# EasyEDA Pro project LOONGSON_DOCKER.epro, schematic Schematic1

## Sheets
1 interfaces: Create Date: 2025-02-27; Page Name: interfaces; Project Name: LOONGSON_99PI_DOCKER; Schematic Name: Schematic1; Update Date: 2025-03-01; Company: 嘉立创EDA; Page Size: A4; Version: V1.0
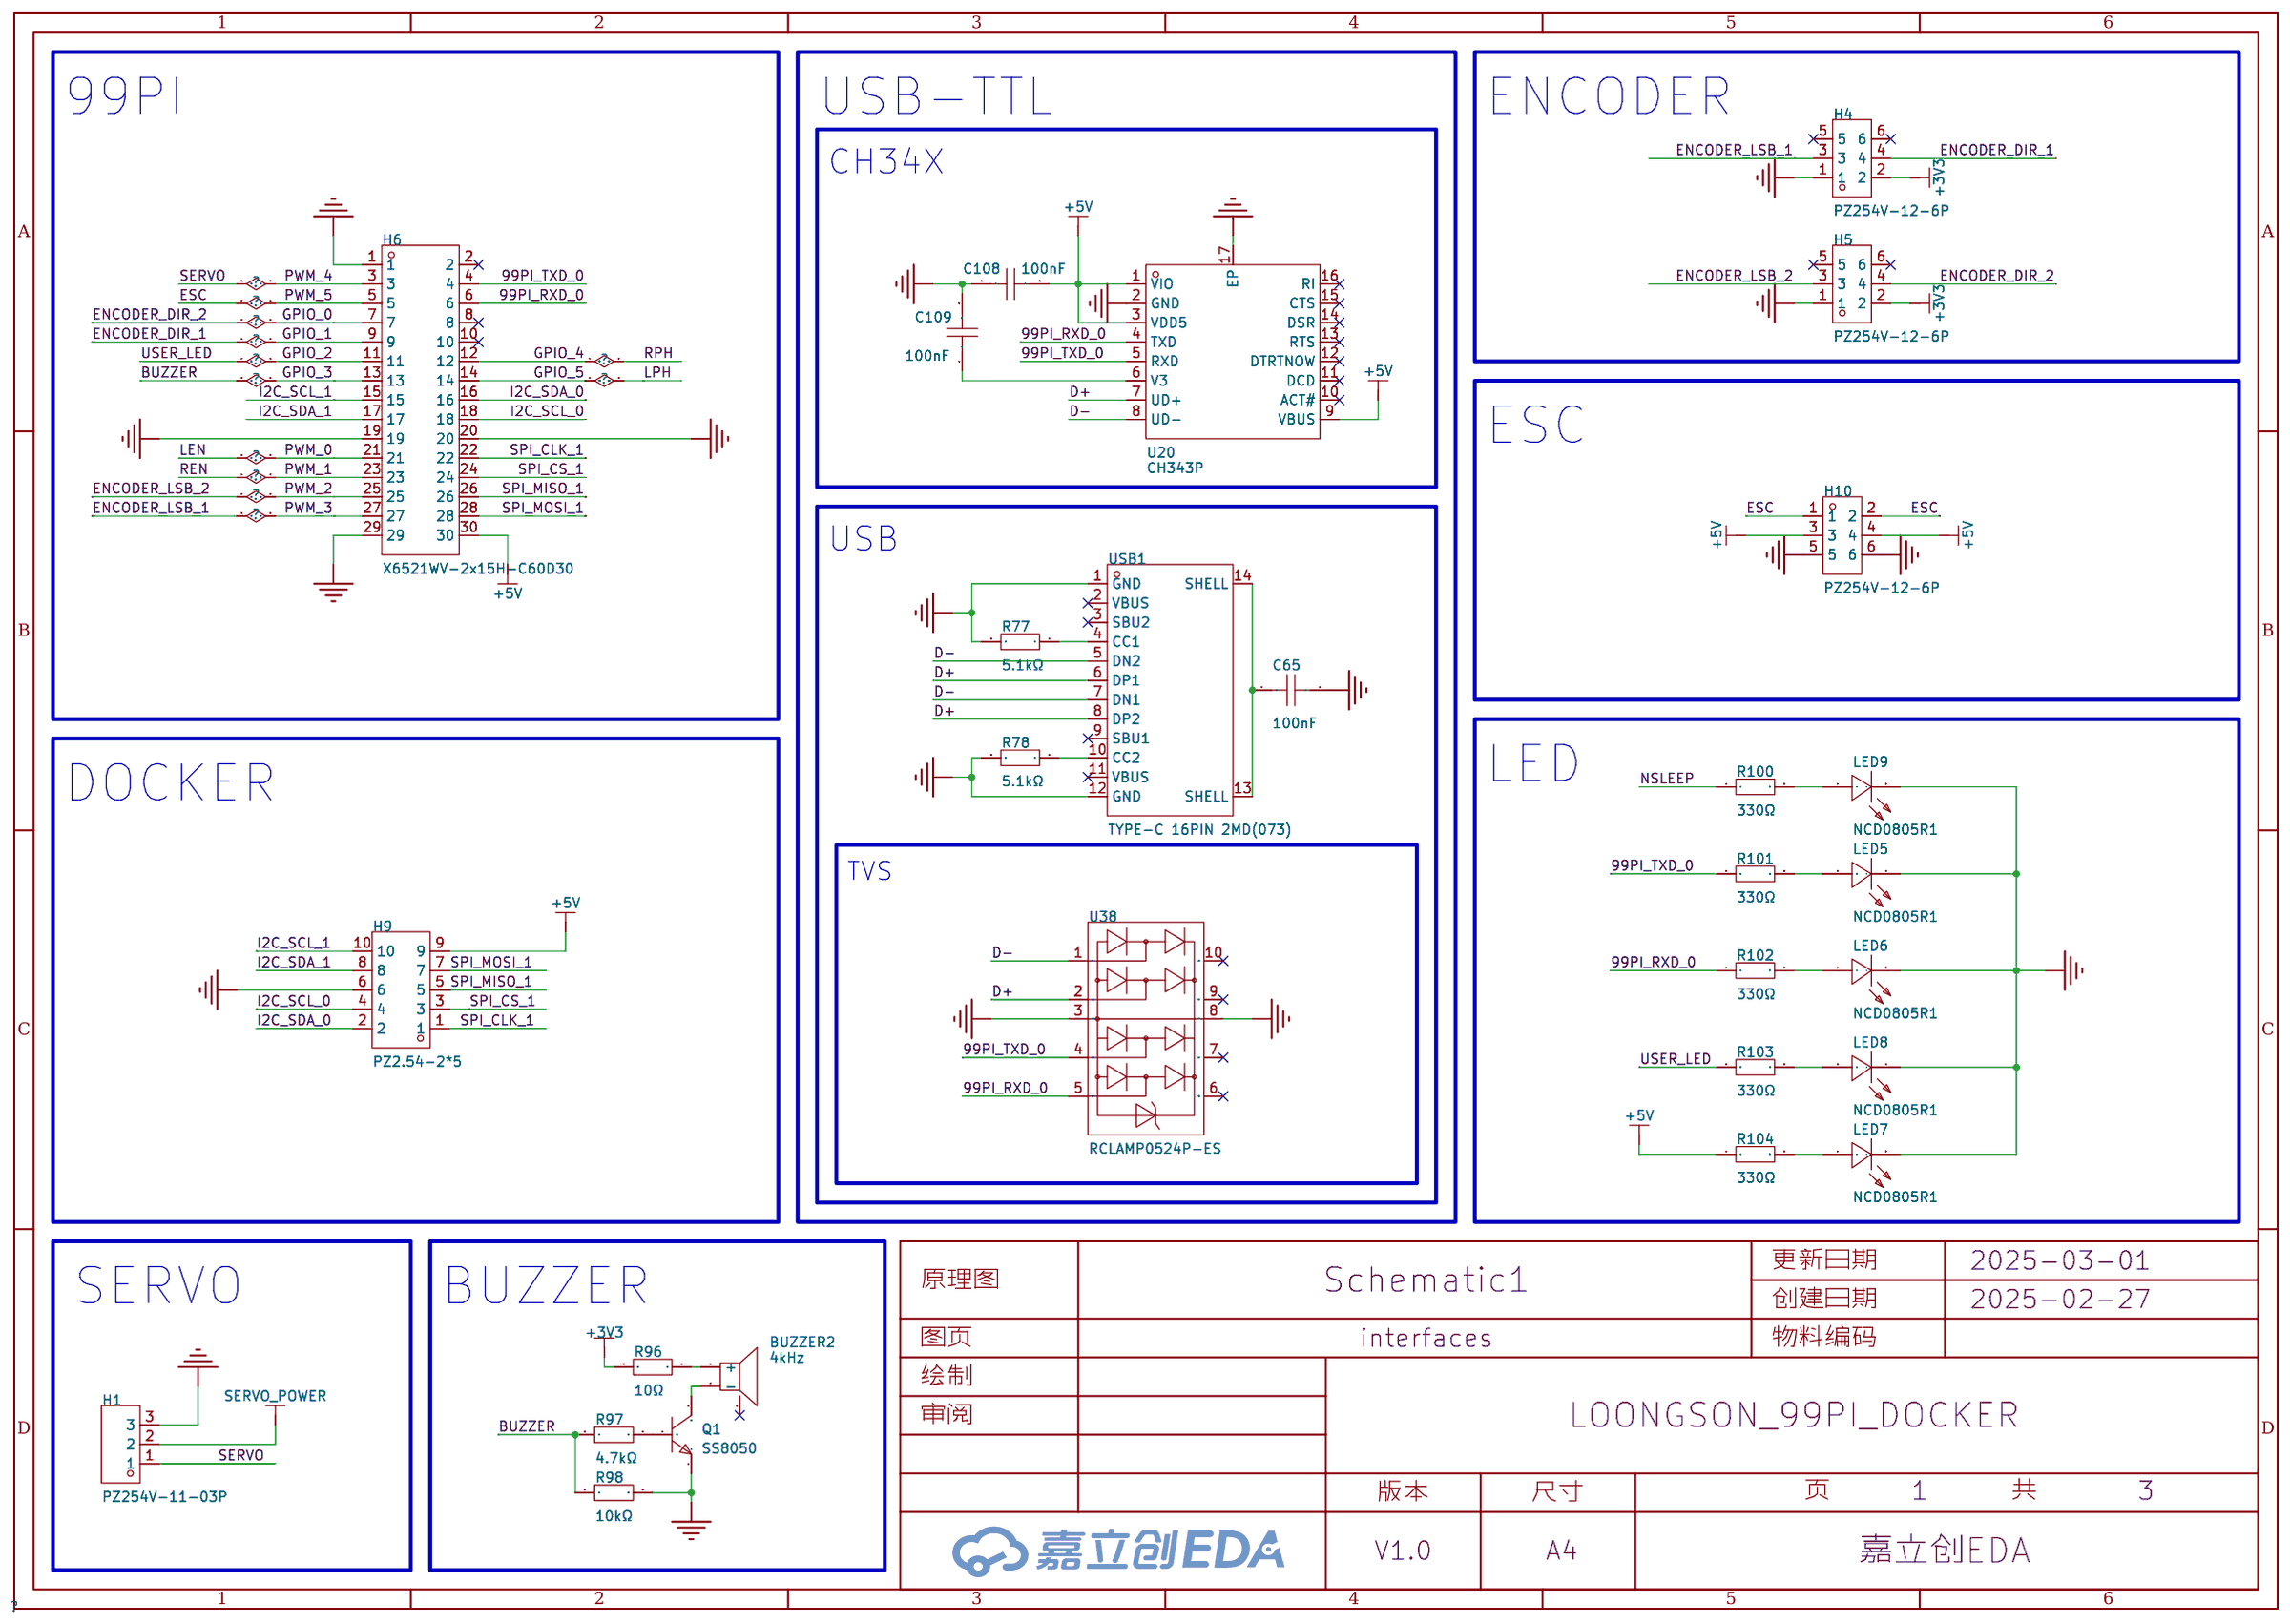
[diagram p0: interfaces]
2 power: Page Name: power; Update Date: 2025-03-06
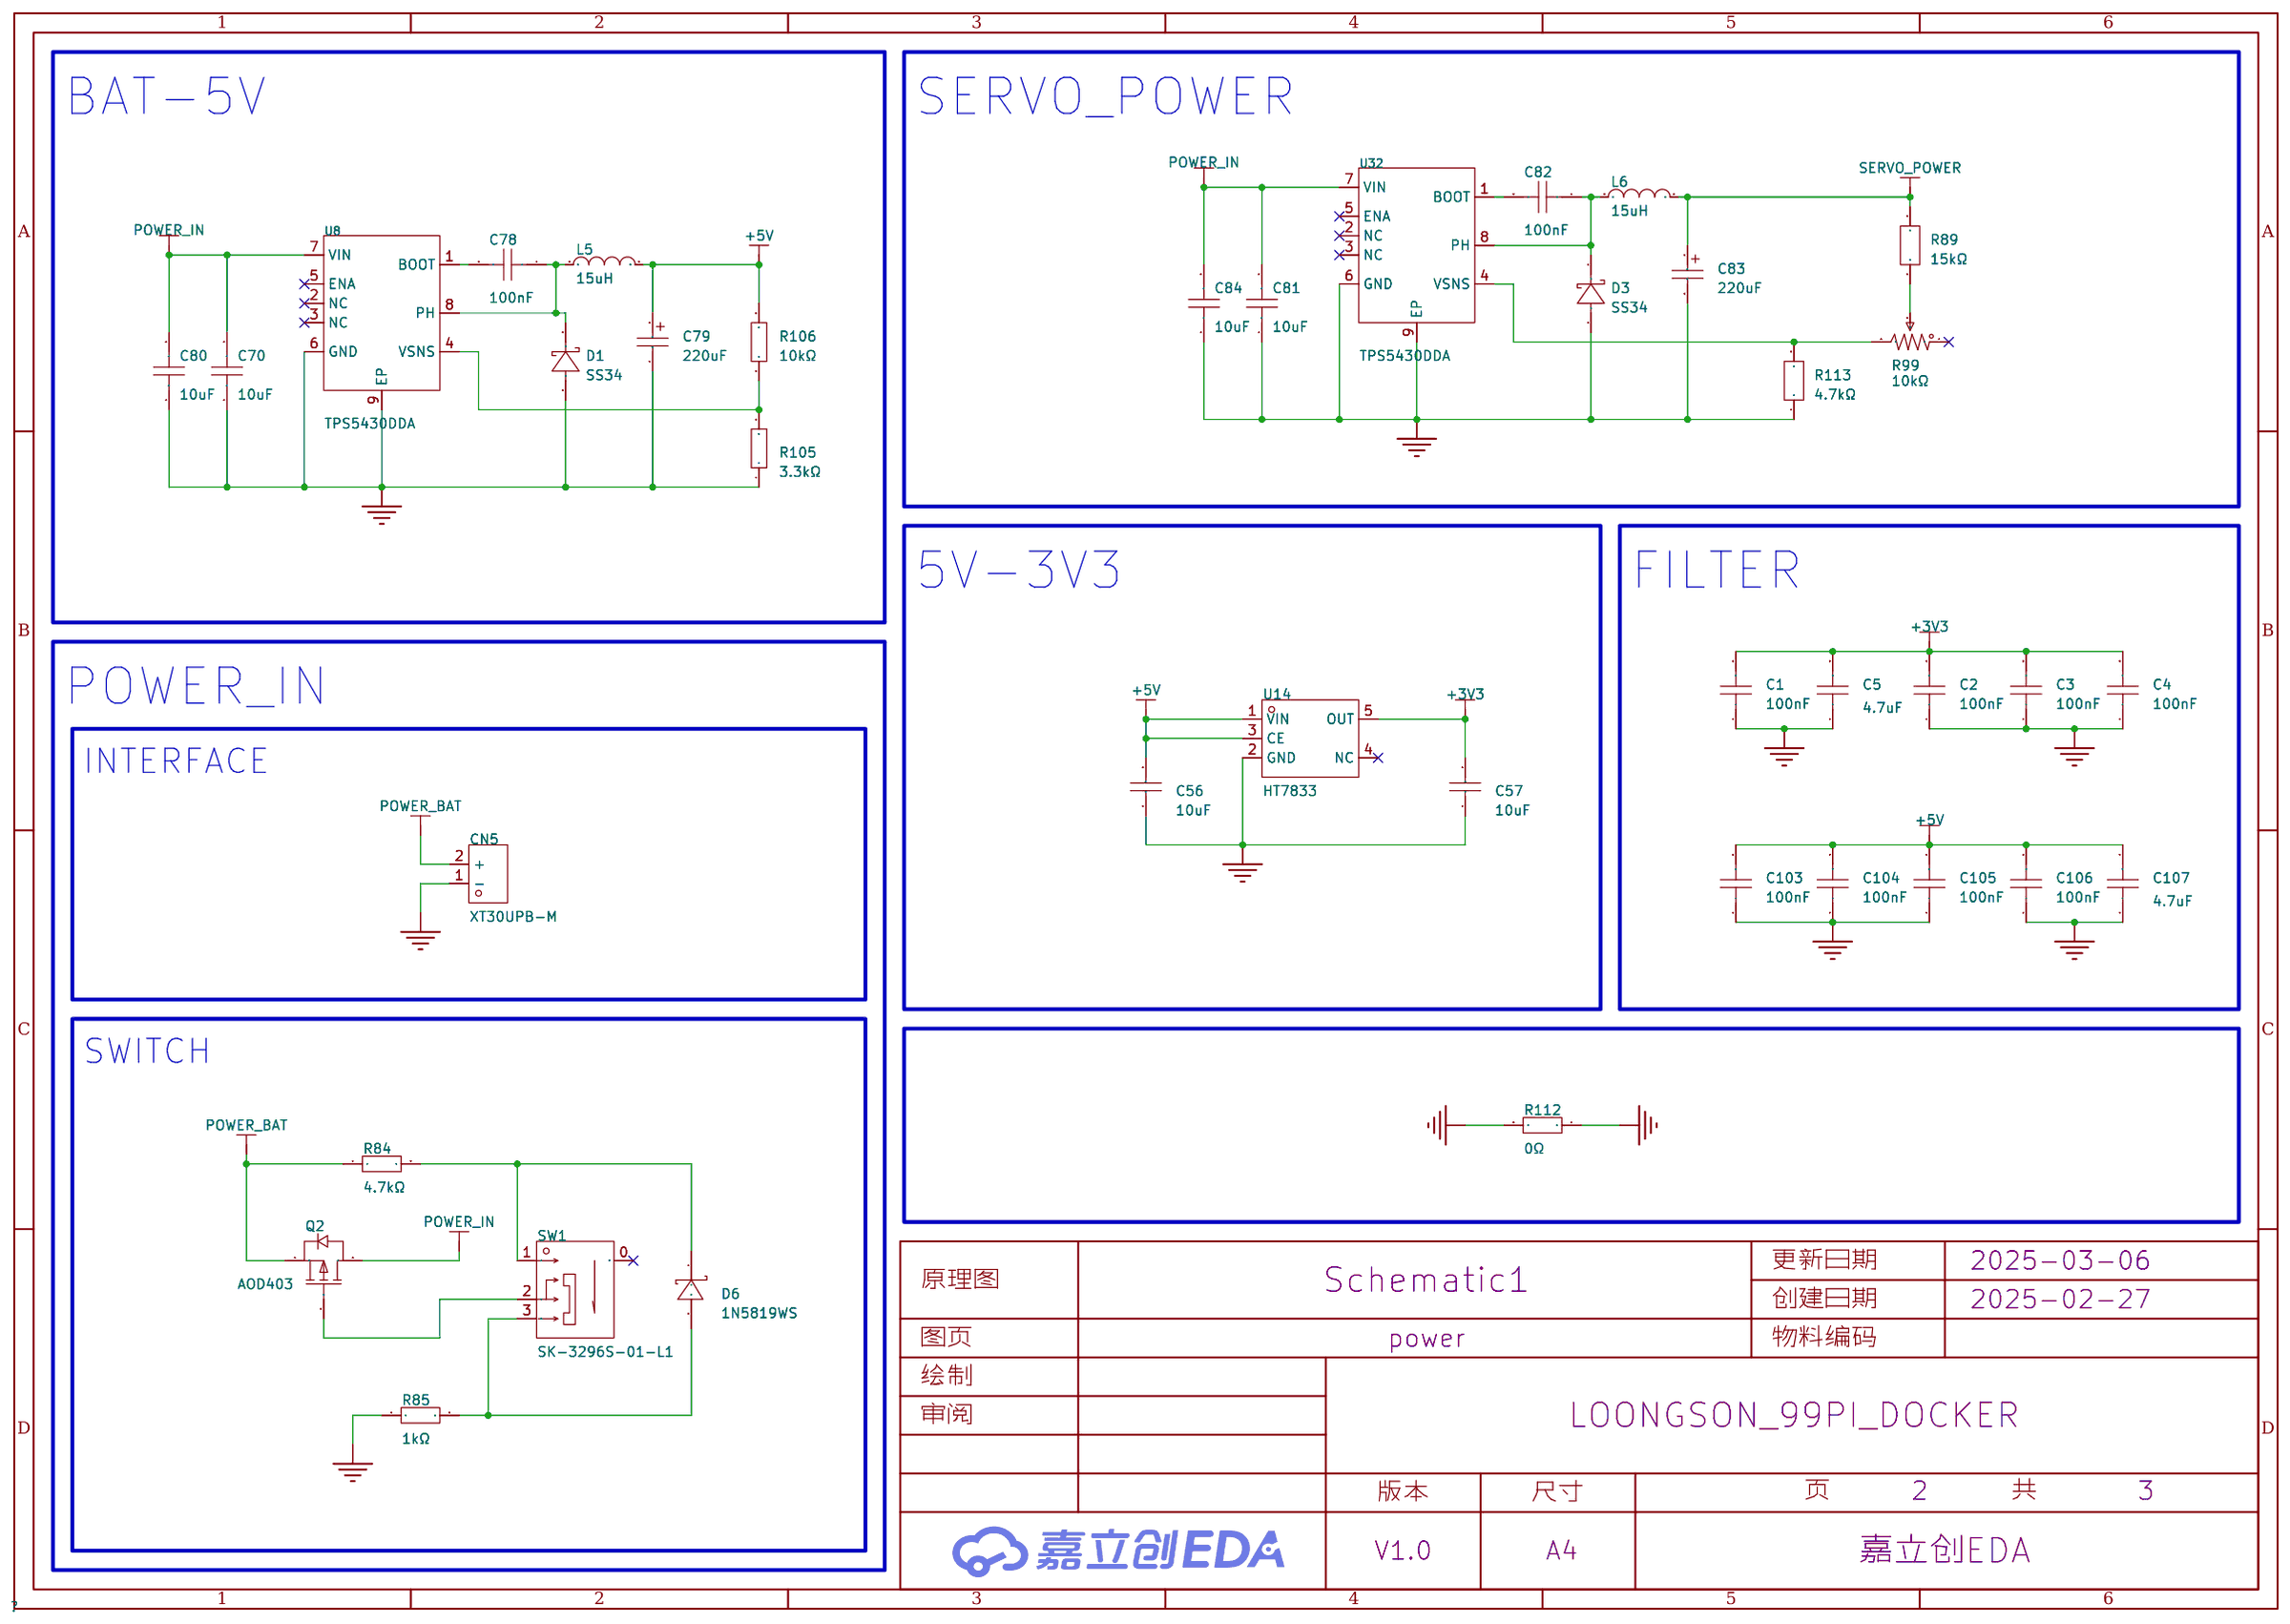
[diagram p1: power]
3 drivers: Page Name: drivers; Update Date: 2025-03-06
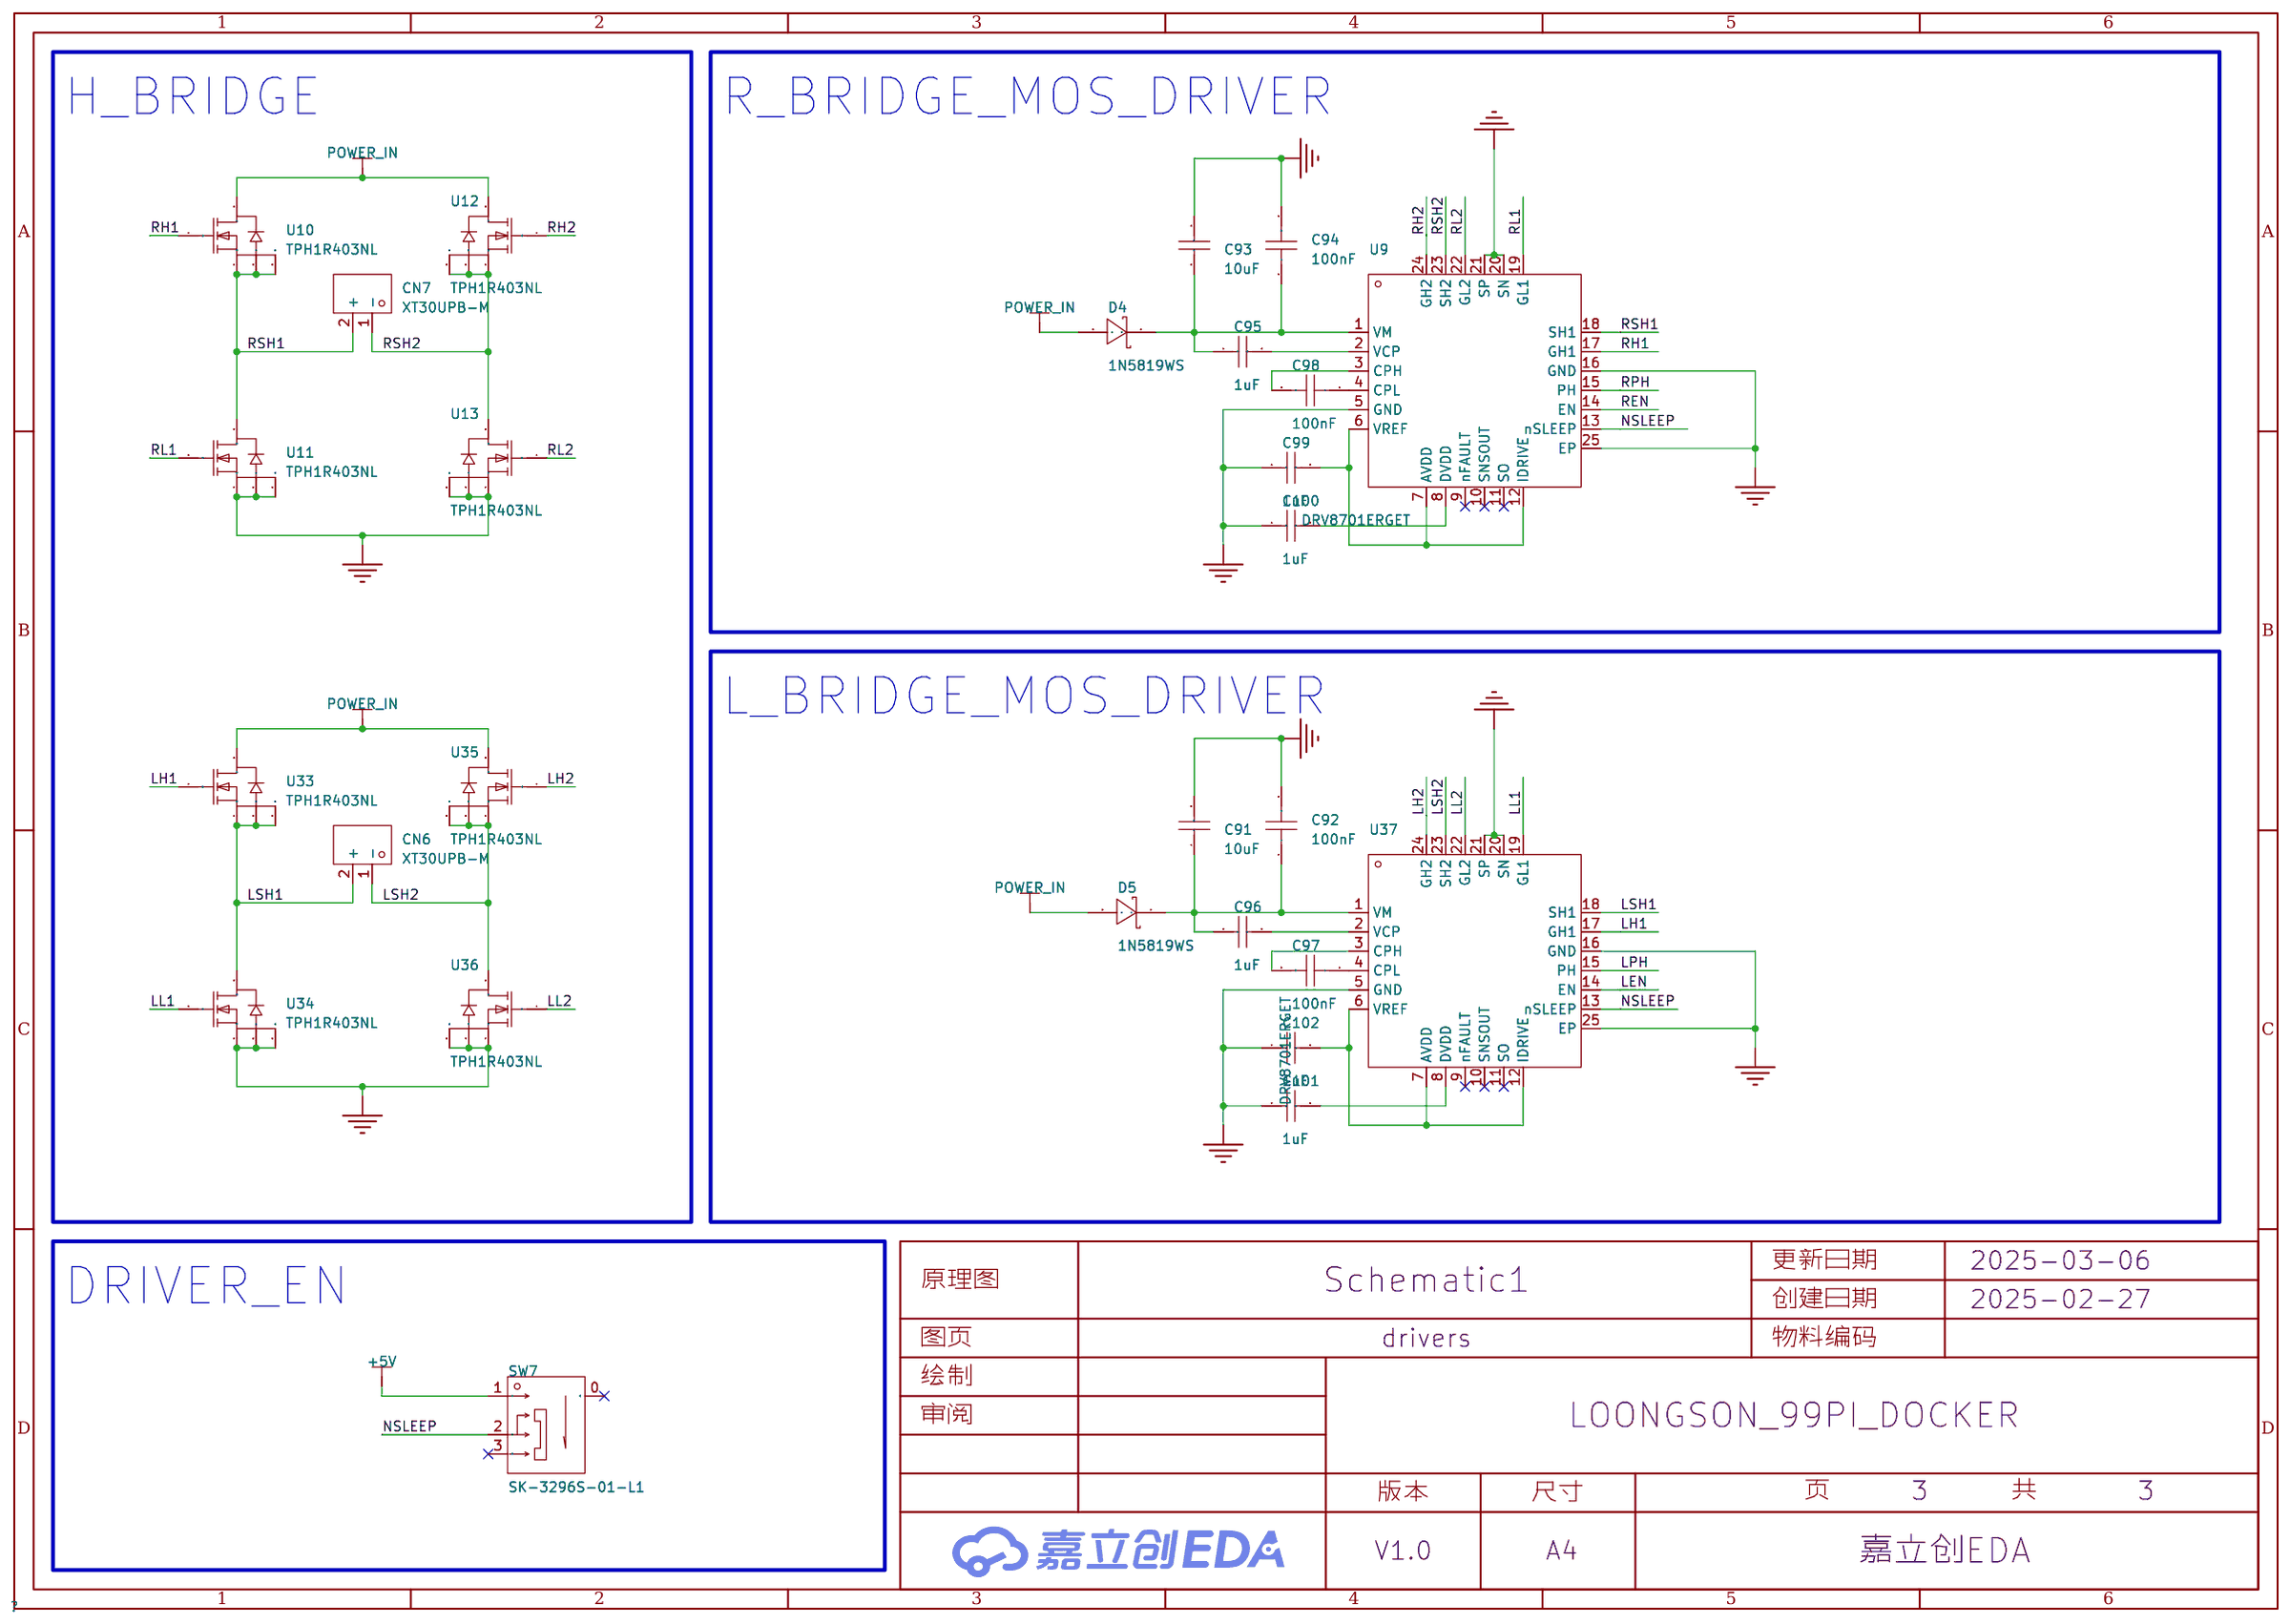
[diagram p2: drivers]

## Parts
sheet drivers
C91  10uF  [C0402]
C92  100nF  [C0402]
C93  10uF  [C0402]
C94  100nF  [C0402]
C95  1uF  [C0402]
C96  1uF  [C0402]
C97  100nF  [C0402]
C98  100nF  [C0402]
C99  1uF  [C0402]
C100  1uF  [C0402]
C101  1uF  [C0402]
C102  1uF  [C0402]
CN6  XT30UPB-M  [CONN-TH_XT30UPB-M]
CN7  XT30UPB-M  [CONN-TH_XT30UPB-M]
D4  1N5819WS  [SOD-323_L1.8-W1.3-LS2.5-RD]
D5  1N5819WS  [SOD-323_L1.8-W1.3-LS2.5-RD]
SW7  SK-3296S-01-L1  [SW-SMD_3P-P1.50_L2.7-W6.6]
U9  DRV8701ERGET  [VQFN-24_L4.0-W4.0-P0.50-BL-EP2.5]
U10  TPH1R403NL  [TDSON-8_L5.9-W5.2-P1.27-BL]
U11  TPH1R403NL  [TDSON-8_L5.9-W5.2-P1.27-BL]
U12  TPH1R403NL  [TDSON-8_L5.9-W5.2-P1.27-BL]
U13  TPH1R403NL  [TDSON-8_L5.9-W5.2-P1.27-BL]
U33  TPH1R403NL  [TDSON-8_L5.9-W5.2-P1.27-BL]
U34  TPH1R403NL  [TDSON-8_L5.9-W5.2-P1.27-BL]
U35  TPH1R403NL  [TDSON-8_L5.9-W5.2-P1.27-BL]
U36  TPH1R403NL  [TDSON-8_L5.9-W5.2-P1.27-BL]
U37  DRV8701ERGET  [VQFN-24_L4.0-W4.0-P0.50-BL-EP2.5]
sheet interfaces
BUZZER2  4kHz  [BUZ-SMD_L5.0-W5.5-P4.60]
C65  100nF  [C0402]
C108  100nF  [C0402]
C109  100nF  [C0402]
H1  PZ254V-11-03P  [HDR-TH_3P-P2.54-V-M]
H4  PZ254V-12-6P  [HDR-TH_6P-P2.54-V-M-R2-C3-S2.54]
H5  PZ254V-12-6P  [HDR-TH_6P-P2.54-V-M-R2-C3-S2.54]
H6  X6521WV-2x15H-C60D30  [HDR-TH_30P-P2.54-V-M-R2-C15-S2.54-BL]
H9  PZ2.54-2*5  [HDR-TH_10P-P2.54-V-M-R2-C5-S2.54-1]
H10  PZ254V-12-6P  [HDR-TH_6P-P2.54-V-M-R2-C3-S2.54]
LED5  NCD0805R1  [LED0805-R-RD]
LED6  NCD0805R1  [LED0805-R-RD]
LED7  NCD0805R1  [LED0805-R-RD]
LED8  NCD0805R1  [LED0805-R-RD]
LED9  NCD0805R1  [LED0805-R-RD]
Q1  SS8050  [SOT-23-3_L2.9-W1.3-P1.90-LS2.4-BR]
R77  5.1kΩ  [R0402]
R78  5.1kΩ  [R0402]
R96  10Ω  [R0402]
R97  4.7kΩ  [R0402]
R98  10kΩ  [R0402]
R100  330Ω  [R0402]
R101  330Ω  [R0402]
R102  330Ω  [R0402]
R103  330Ω  [R0402]
R104  330Ω  [R0402]
U20  CH343P  [TQFN-16_L3.0-W3.0-P0.50-BL-EP1.7]
U38  RCLAMP0524P-ES  [DFN2510-10_L2.5-W1.0-P0.50-BL]
USB1  TYPE-C 16PIN 2MD(073)  [USB-C-SMD_TYPE-C-6PIN-2MD-073]
sheet power
C1  100nF  [C0402]
C2  100nF  [C0402]
C3  100nF  [C0402]
C4  100nF  [C0402]
C5  4.7uF  [C0402]
C56  10uF  [C0402]
C57  10uF  [C0402]
C70  10uF  [C0603]
C78  100nF  [C0603]
C79  220uF  [CASE-B_3528]
C80  10uF  [C0603]
C81  10uF  [C0603]
C82  100nF  [C0603]
C83  220uF  [CASE-B_3528]
C84  10uF  [C0603]
C103  100nF  [C0402]
C104  100nF  [C0402]
C105  100nF  [C0402]
C106  100nF  [C0402]
C107  4.7uF  [C0402]
CN5  XT30UPB-M  [CONN-TH_XT30UPB-M]
D1  SS34  [SMA_L4.3-W2.5-LS5.0-RD]
D3  SS34  [SMA_L4.3-W2.5-LS5.0-RD]
D6  1N5819WS  [SOD-323_L1.8-W1.3-LS2.5-RD]
L5  15uH  [IND-SMD_L4.6-W4.2_SMMS0420]
L6  15uH  [IND-SMD_L4.6-W4.2_SMMS0420]
Q2  AOD403  [TO-252-3_L6.6-W6.1-P4.58-LS10.1-BR-2]
R84  4.7kΩ  [R0603]
R85  1kΩ  [R0603]
R89  15kΩ  [R0603]
R99  10kΩ  [RES-ADJ-TH_3P-L10.0-W10.0-P2.50-L]
R105  3.3kΩ  [R0603]
R106  10kΩ  [R0603]
R112  0Ω  [R0402]
R113  4.7kΩ  [R0603]
SW1  SK-3296S-01-L1  [SW-SMD_3P-P1.50_L2.7-W6.6]
U8  TPS5430DDA  [ESOP-8_L4.9-W3.9-P1.27-LS6.0-BL-EP-2]
U14  HT7833  [SOT-23-5_L2.9-W1.6-P0.95-LS2.8-BL]
U32  TPS5430DDA  [ESOP-8_L4.9-W3.9-P1.27-LS6.0-BL-EP-2]

## Library data of the parts
C56 C57 C91 C93 = CL05A106MQ5NUNC: 容值:10uF;精度:±20%;额定电压:6.3V;材质(温度系数):X5R;; LCSC Part Name: 10uF ±20% 6.3V; Supplier Part: C15525; Manufacturer: SAMSUNG(三星); Supplier Footprint: 0402; JLCPCB Part Class: 基础库; Datasheet: https://atta.szlcsc.com/upload/public/pdf/source/20220823/2B02EE04F8F211D38A52DCB16EB6BEBA.pdf; Supplier: LCSC; Tolerance: ±20%; Voltage Rated: 6.3V; Temperature Coefficient: X5R
C1-C4 C65 C92 C94 C97 C98 C103-C106 C108 C109 = GRM155R71H104KE14D: 容值:100nF;精度:±10%;额定电压:50V;材质(温度系数):X7R;; LCSC Part Name: 100nF ±10% 50V; Supplier Part: C77020; Manufacturer: muRata(村田); Supplier Footprint: 0402; JLCPCB Part Class: 扩展库; Datasheet: https://atta.szlcsc.com/upload/public/pdf/source/20180326/C77020_39BD49C951FF1AF0DB1F1FAC5AC1E401.pdf; Supplier: LCSC; Tolerance: ±10%; Voltage Rated: 50V; Temperature Coefficient: X7R
C95 C96 C99-C102 = CL05A105KP5NNNC: 容值:1uF;精度:±10%;额定电压:10V;材质(温度系数):X5R;; LCSC Part Name: 1uF ±10% 10V; Supplier Part: C14445; Manufacturer: SAMSUNG(三星); Supplier Footprint: 0402; JLCPCB Part Class: 扩展库; Datasheet: https://atta.szlcsc.com/upload/public/pdf/source/20160218/1457707763339.pdf; Supplier: LCSC; Tolerance: ±10%; Voltage Rated: 10V; Temperature Coefficient: X5R
CN5-CN7 = XT30UPB-M: 类别:-;类型1:-;; LCSC Part Name: AMASS(艾迈斯)板载立式 航模锂电池控制器连接器插头 公头XT30UPB-M; Supplier Part: C428721; Manufacturer: AMASS(艾迈斯); JLCPCB Part Class: 扩展库; Datasheet: https://atta.szlcsc.com/upload/public/pdf/source/20230412/7B5DFEF57C9EA5273853390C734B3AC5.pdf; Supplier: LCSC; Brand: 艾迈斯; Type: 航模插头; Colour: 黄色; RatedVoltage: DC 500V; InterfaceType: 公头; MetalMaterial: 镀金; InsulationMaterial: PA; RatedCurrent: 15A; contact resistance: 0.65mΩ
D4-D6 = 1N5819WS_C191023: 正向压降(Vf):600mV@1A;直流反向耐压(Vr):40V;平均整流电流(Io):1A;; LCSC Part Name: 电压:40V 电流:1A; Supplier Part: C191023; Manufacturer: Hottech(合科泰); Supplier Footprint: SOD-323; JLCPCB Part Class: 基础库; Datasheet: https://atta.szlcsc.com/upload/public/pdf/source/20220428/3CB86FD8D28D653594B4E35F9D5AEFD9.pdf; Supplier: LCSC; Forward Voltage (Vf@If): 600mV@1A; Reverse Voltage (Vr): 40V; Average Rectified Current (Io): 1A
SW1 SW7 = SK-3296S-01-L1: 电路结构:单刀双掷;安装方式:卧贴;开关颜色:黑色;额定电流(DC):50mA;额定电压(DC):12V;额定电流(AC):50mA;额定电压(AC):12V;机械寿命:1万次;; LCSC Part Name: 柄长1.5mm 卧贴双档 滑动开关; Supplier Part: C319020; Manufacturer: XKB Connectivity(中国星坤); Supplier Footprint: SMD; JLCPCB Part Class: 扩展库; Datasheet: https://atta.szlcsc.com/upload/public/pdf/source/20211011/33977E7F5E3AE40A3E3DC6795807E20F.pdf; Supplier: LCSC; Circuit: 单刀双掷; Actuator Style: 矩形柱状; Pin Style: SMD接片; Switch Length: 7.8mm; Switch Width: 2.75mm; Switch Height: 1.35mm; Mounting Style: 卧贴; Actuator Color: 黑色; Current Rating (DC): 50mA; Voltage Rating (DC): 12V; Current Rating (AC): 50mA; Voltage Rating (AC): 12V; Mechanical Life: 1万次; Operating Temperature: -40℃~+85℃
U9 U37 = DRV8701ERGET: 类型:有刷直流电机;电源电压:0V~5.5V;输出电流:-;接口:并行;; Supplier Part: C132049; Manufacturer: TI(德州仪器); Supplier Footprint: VQFN-24(4x4); JLCPCB Part Class: 扩展库; Datasheet: https://atta.szlcsc.com/upload/public/pdf/source/20170925/C132049_1506321643935990409.pdf; Supplier: LCSC; Type: 有刷直流电机; Supply Voltage: 0V~5.5V; Interface: 并行; Operating Temperature: -40℃~+125℃@(Ta)
U10-U13 U33-U36 = TPH1R403NL_C19268167: Supplier Part: C19268167; Manufacturer: TECH PUBLIC(台舟); Supplier Footprint: DFN(5x6); Datasheet: https://atta.szlcsc.com/upload/public/pdf/source/20231201/E668D9B30DA1C5FDF2CA4EE637776407.pdf; Supplier: LCSC
BUZZER2 = MLT-5020: 驱动方式:无源(外部驱动);构造类型:电磁式;频率:4kHz;; Supplier Part: C94598; Manufacturer: 华能; Supplier Footprint: SMD,5x5mm; JLCPCB Part Class: 扩展库; Datasheet: https://atta.szlcsc.com/upload/public/pdf/source/20210811/111454390007D221D7259018FB170E62.pdf; Supplier: LCSC; Driver Circuitry: 无源(外部驱动); Technology: 电磁式; Length: 5.2mm; Width: 5.2mm; Height: 2.5mm
H1 = PZ254V-11-03P: 插针结构:1x3P;间距:2.54mm;行距:-;圆针/方针:方针;安装类型:直插;排数:单排;总PIN位数:3P;额定电流:3A;额定电压:250V;配合针长度:6mm;塑高:2.5mm;端接针长度:3mm;工作温度范围:-40℃~+105℃;颜色:黑色;; LCSC Part Name: 间距:2.54mm 1x3P 直插 方针; Supplier Part: C2937625; Manufacturer: XFCN(兴飞); Supplier Footprint: 插件,P=2.54mm; JLCPCB Part Class: 扩展库; Datasheet: https://atta.szlcsc.com/upload/public/pdf/source/20200309/C492402_8335C3D49C4E4C618838D59BB1D024C1.pdf; Supplier: LCSC; Pin Structure: 1x3P; Pitch: 2.54mm; Circluar Pins/Square Pins: 方针; Mounting Type: 直插; Number of Rows: 单排; Number of Pins: 3P; Current Rating (Max): 3A; Voltage Rating (Max): 250V; Length of Mating Pin: 6mm; Insulation Height: 2.5mm; Length of End Connection Pin: 3mm; Operating Temperature Range: -40℃~+105℃; Color: 黑色
H4 H5 H10 = PZ254V-12-6P: 插针结构:2x3P;间距:2.54mm;行距:2.54mm;圆针/方针:方针;安装类型:直插;排数:双排;总PIN位数:6P;额定电流:-;额定电压:-;配合针长度:6mm;塑高:2.5mm;端接针长度:3mm;触头材质:黄铜;触头镀层:-;工作温度范围:-40℃~+105℃;颜色:黑色;; LCSC Part Name: 间距:2.54mm 2x3P 直插 方针; Supplier Part: C492420; Manufacturer: XFCN(兴飞); Supplier Footprint: 插件,P=2.54mm; JLCPCB Part Class: 扩展库; Datasheet: https://atta.szlcsc.com/upload/public/pdf/source/20200309/C492420_BAECB307B001054C09D200388220EAE6.pdf; Supplier: LCSC; Pin Structure: 2x3P; Pitch: 2.54mm; Row Spacing: 2.54mm; Circluar Pins/Square Pins: 方针; Mounting Type: 直插; Number of Rows: 双排; Number of Pins: 6P; Length of Mating Pin: 6mm; Insulation Height: 2.5mm; Length of End Connection Pin: 3mm; Contact Material: 黄铜; Operating Temperature Range: -40℃~+105℃; Color: 黑色
H6 = X6521WV-2x15H-C60D30: 插针结构:2x15P;间距:2.54mm;行距:2.54mm;圆针/方针:方针;安装类型:-;排数:双排;总PIN位数:30P;额定电流:3A;额定电压:250V;配合针长度:-;塑高:2.5mm;端接针长度:-;触头材质:黄铜;触头镀层:金;工作温度范围:-40℃~+105℃;焊接温度(最大值):260℃;颜色:黑色;; LCSC Part Name: 2x15P 间距:2.54mm 方针; Supplier Part: C725887; Manufacturer: XKB Connection(中国星坤); Supplier Footprint: 插件,P=2.54mm; JLCPCB Part Class: 扩展库; Datasheet: https://atta.szlcsc.com/upload/public/pdf/source/20230814/F1C4971E164A170E66FC7330ABFF6881.pdf; Supplier: LCSC; Pin Structure: 2x15P; Pitch: 2.54mm; Row Spacing: 2.54mm; Circluar Pins/Square Pins: 方针; Number of Rows: 双排; Number of Pins: 30P; Current Rating (Max): 3A; Voltage Rating (Max): 250V; Insulation Height: 2.5mm; Contact Material: 黄铜; Contact Plating: 金; Operating Temperature Range: -40℃~+105℃; Soldering Temperature(Max): 260℃; Color: 黑色
H9 = PZ2.54-2*5: 插针结构:2x5P;间距:2.54mm;排数:双排;总PIN位数:10P;; Supplier Part: C5156677; Manufacturer: ZHOURI(洲日); Supplier Footprint: 插件,P=2.54mm; JLCPCB Part Class: 扩展库; Datasheet: https://atta.szlcsc.com/upload/public/pdf/source/20220923/FF9D303E4B04AC19FF78D5B876650950.pdf; Supplier: LCSC; Pin Structure: 2x5P; Pitch: 2.54mm; Number of Rows: 双排; Number of Pins: 10P
LED5-LED9 = NCD0805R1: 灯头类型:-;发光颜色:红色;正向电压(VF):1.6V~2.6V;功率:65mW;正向电流:20mA;主波长:615nm~630nm;二极管配置:独立二极管;透镜颜色:无色透明透镜;色温:-;发光强度:67mcd~195mcd;发光角度:130°;载带方式:-;工作温度:-30℃~+85℃;; Supplier Part: C84256; Manufacturer: 国星光电; Supplier Footprint: 0805; JLCPCB Part Class: 基础库; Datasheet: https://atta.szlcsc.com/upload/public/pdf/source/20200820/C84256_F0A75A43B3EAD75808600A0514C76B99.pdf; Supplier: LCSC; Emitted Color: 红色; Forward Voltage (VF): 1.6V~2.6V; Power Dissipation: 65mW; Forward Current: 20mA; Dominant Wavelength: 615nm~630nm; Diode Configuration: 独立二极管; Lens Color: 无色透明透镜; Luminous Intensity: 67mcd~195mcd; Viewing Angle: 130°; Operating Temperature: -30℃~+85℃
Q1 = SS8050_C2150: 晶体管类型:NPN;集电极电流(Ic):1.5A;集射极击穿电压(Vceo):25V;功率(Pd):300mW;直流电流增益(hFE@Ic,Vce):200@100mA,1V;; LCSC Part Name: NPN 电流:1.5A 耐压:25V hfe=200~350; Supplier Part: C2150; Manufacturer: CJ(江苏长电/长晶); Supplier Footprint: SOT-23; JLCPCB Part Class: 基础库; Datasheet: https://atta.szlcsc.com/upload/public/pdf/source/20230322/AEE86F4B043774EFF80CAEA14A37D9E9.pdf; Supplier: LCSC; Transistor Type: NPN; Collector Current (Ic): 1.5A; Collector-Emitter Breakdown Voltage (Vceo): 25V; Power Dissipation (Pd): 300mW; DC Current Gain (hFE@Ic,Vce): 200@100mA,1V; Transition Frequency (fT): 100MHz; Collector Cut-Off Current (Icbo): 100nA; Collector-Emitter Saturation Voltage (VCE(sat)@Ic,Ib): 500mV@800mA,80mA
R77 R78 = 0402WGF5101TCE: 电阻类型:厚膜电阻;阻值:5.1kΩ;精度:±1%;功率:62.5mW;最大工作电压:50V;温度系数:±100ppm/℃;; LCSC Part Name: 5.1kΩ ±1% 62.5mW 厚膜电阻; Supplier Part: C25905; Manufacturer: UNI-ROYAL(厚声); Supplier Footprint: 0402; JLCPCB Part Class: 基础库; Datasheet: https://atta.szlcsc.com/upload/public/pdf/source/20200306/C422600_1E6D84923E4A46A82E41ADD87F860B5C.pdf; Supplier: LCSC; Type: 厚膜电阻; Tolerance: ±1%; Power(Watts): 62.5mW; Overload Voltage (Max): 50V; Temperature Coefficient: ±100ppm/℃; Operating Temperature Range: -55℃~+155℃
R96 = 0402WGF100JTCE: 电阻类型:厚膜电阻;阻值:10Ω;精度:±1%;功率:62.5mW;最大工作电压:50V;温度系数:±200ppm/℃;; LCSC Part Name: 10Ω ±1% 62.5mW 厚膜电阻; Supplier Part: C25077; Manufacturer: UNI-ROYAL(厚声); Supplier Footprint: 0402; JLCPCB Part Class: 基础库; Datasheet: https://atta.szlcsc.com/upload/public/pdf/source/20200306/C422600_1E6D84923E4A46A82E41ADD87F860B5C.pdf; Supplier: LCSC; Type: 厚膜电阻; Tolerance: ±1%; Power(Watts): 62.5mW; Overload Voltage (Max): 50V; Temperature Coefficient: ±200ppm/℃; Operating Temperature Range: -55℃~+155℃
R97 = 0402WGF4701TCE: 电阻类型:厚膜电阻;阻值:4.7kΩ;精度:±1%;功率:62.5mW;最大工作电压:50V;温度系数:±100ppm/℃;; LCSC Part Name: 4.7kΩ ±1% 62.5mW 厚膜电阻; Supplier Part: C25900; Manufacturer: UNI-ROYAL(厚声); Supplier Footprint: 0402; JLCPCB Part Class: 基础库; Datasheet: https://atta.szlcsc.com/upload/public/pdf/source/20200306/C422600_1E6D84923E4A46A82E41ADD87F860B5C.pdf; Supplier: LCSC; Type: 厚膜电阻; Tolerance: ±1%; Power(Watts): 62.5mW; Overload Voltage (Max): 50V; Temperature Coefficient: ±100ppm/℃; Operating Temperature Range: -55℃~+155℃
R98 = 0402WGF1002TCE: 电阻类型:厚膜电阻;阻值:10kΩ;精度:±1%;功率:62.5mW;最大工作电压:50V;温度系数:±100ppm/℃;; LCSC Part Name: 10kΩ ±1% 62.5mW 厚膜电阻; Supplier Part: C25744; Manufacturer: UNI-ROYAL(厚声); Supplier Footprint: 0402; JLCPCB Part Class: 基础库; Datasheet: https://atta.szlcsc.com/upload/public/pdf/source/20200306/C422600_1E6D84923E4A46A82E41ADD87F860B5C.pdf; Supplier: LCSC; Type: 厚膜电阻; Tolerance: ±1%; Power(Watts): 62.5mW; Overload Voltage (Max): 50V; Temperature Coefficient: ±100ppm/℃; Operating Temperature Range: -55℃~+155℃
R100-R104 = 0402WGF3300TCE: 电阻类型:厚膜电阻;阻值:330Ω;精度:±1%;功率:62.5mW;最大工作电压:50V;温度系数:±100ppm/℃;; LCSC Part Name: 330Ω ±1% 62.5mW 厚膜电阻; Supplier Part: C25104; Manufacturer: UNI-ROYAL(厚声); Supplier Footprint: 0402; JLCPCB Part Class: 基础库; Datasheet: https://atta.szlcsc.com/upload/public/pdf/source/20200306/C422600_1E6D84923E4A46A82E41ADD87F860B5C.pdf; Supplier: LCSC; Type: 厚膜电阻; Tolerance: ±1%; Power(Watts): 62.5mW; Overload Voltage (Max): 50V; Temperature Coefficient: ±100ppm/℃; Operating Temperature Range: -55℃~+155℃
U20 = CH343P: 应用功能:-;接口协议:-;; Supplier Part: C2846043; Manufacturer: WCH(南京沁恒); Supplier Footprint: TQFN-16-EP(3x3); JLCPCB Part Class: 扩展库; Datasheet: https://atta.szlcsc.com/upload/public/pdf/source/20211010/C2846043_7FA705E1F14A2906F6A2AFA45FA28209.pdf; Supplier: LCSC
U38 = RCLAMP0524P-ES: 极性:单向;反向截止电压(Vrwm):5V;最大钳位电压:12V;峰值脉冲电流(Ipp):4.5A;峰值脉冲功率(Ppp):60W;击穿电压:6V;; LCSC Part Name: 0524P，4路单向ESD静电防护器件，20kV，CJ：0.6pF；HDMI/USB高速接口通讯防护; Supplier Part: C5180236; Manufacturer: ElecSuper(静芯微); Supplier Footprint: DFN2510-10L; JLCPCB Part Class: 扩展库; Datasheet: https://atta.szlcsc.com/upload/public/pdf/source/20240905/F7E709DD0DC794A5B81F30510399CED3.pdf; Supplier: LCSC; polarity: 单向; Reverse Stand-Off Voltage (Vrwm): 5V; Maximum Clamping Voltage: 12V; Peak Pulse Current (Ipp): 4.5A; Peak Pulse Power Dissipation (Ppp): 60W; Breakdown Voltage: 6V; Reverse Leakage Current (Ir): 1uA; Number of Lines: 四路; Type: ESD
USB1 = TYPE-C 16PIN 2MD(073): 连接器类型:Type-C;标准:USB 3.1;公母:母;安装方式:卧贴;触点数量:16P;端口数量:1;额定电流 - 电源:5A;工作温度范围:-25℃~+85℃;; LCSC Part Name: Type-C 母 卧贴; Supplier Part: C2765186; Manufacturer: SHOU HAN(首韩); Supplier Footprint: SMD; JLCPCB Part Class: 扩展库; Datasheet: https://atta.szlcsc.com/upload/public/pdf/source/20211123/39B17C16241EAC15C5E277BDA434118E.pdf; Supplier: LCSC; Connector Type: Type-C; Standard: USB 3.1; Gender: 母; Mounting Style: 卧贴; Number of Contacts: 16P; Number of Ports: 1; Current Rating - Power (Max): 5A; Operating Temperature Range: -25℃~+85℃; Rated Voltage (Max): 5V; Connect-Disconnect Life: 5千次; Core Colour: 黑色
C5 C107 = CL05A475MQ5NRNC: 容值:4.7uF;精度:±20%;额定电压:6.3V;材质(温度系数):X5R;; LCSC Part Name: 4.7uF ±20% 6.3V; Supplier Part: C307423; Manufacturer: SAMSUNG(三星); Supplier Footprint: 0402; JLCPCB Part Class: 扩展库; Datasheet: https://atta.szlcsc.com/upload/public/pdf/source/20181010/C307423_0E0C4E35F3A09F81C2E5C84E00499E42.pdf; Supplier: LCSC; Tolerance: ±20%; Voltage Rated: 6.3V; Temperature Coefficient: X5R
C70 C80 C81 C84 = CL10A106KP8NNNC: 容值:10uF;精度:±10%;额定电压:10V;材质(温度系数):X5R;; LCSC Part Name: 10uF ±10% 10V; Supplier Part: C19702; Manufacturer: SAMSUNG(三星); Supplier Footprint: 0603; JLCPCB Part Class: 基础库; Datasheet: https://atta.szlcsc.com/upload/public/pdf/source/20160218/1457707763339.pdf; Supplier: LCSC; Tolerance: ±10%; Voltage Rated: 10V; Temperature Coefficient: X5R
C78 C82 = CGA0603X7R104K500JT: 容值:100nF;精度:±10%;额定电压:50V;材质(温度系数):X7R;; LCSC Part Name: 100nF ±10% 50V; Supplier Part: C6119867; Manufacturer: HRE(芯声); Supplier Footprint: 0603; JLCPCB Part Class: 扩展库; Supplier: LCSC; Tolerance: ±10%; Voltage Rated: 50V; Temperature Coefficient: X7R
C79 C83 = TLJB227M006R0500: 容值:220uF;精度:±20%;额定电压:6.3V;等效串联电阻:500mΩ@100kHz;; LCSC Part Name: 220uF ±20% 6.3V; Supplier Part: C30242; Manufacturer: Kyocera AVX; Supplier Footprint: CASE-B-3528; JLCPCB Part Class: 扩展库; Datasheet: https://atta.szlcsc.com/upload/public/pdf/source/20181016/C313517_95E099C94D57B8A6005DAF15C3058A23.pdf; Supplier: LCSC; Tolerance: ±20%; Rated Voltage: 6.3V; Equivalent Series Resistance(ESR): 500mΩ@100kHz; Operating Temperature: -55℃~+125℃
D1 D3 = SS34_C727060: 二极管配置:独立式;正向压降(Vf):550mV@3A;直流反向耐压(Vr):40V;平均整流电流(Io):3A;; LCSC Part Name: 电压:40V 电流:3A; Supplier Part: C727060; Manufacturer: TWGMC(台湾迪嘉); Supplier Footprint: SMA(DO-214AC); JLCPCB Part Class: 扩展库; Datasheet: https://atta.szlcsc.com/upload/public/pdf/source/20200828/C727059_6599B6CAC5F3238B9C33E46794659DBE.pdf; Supplier: LCSC; Diode Configuration: 独立式; Forward Voltage (Vf@If): 550mV@3A; Reverse Voltage (Vr): 40V; Average Rectified Current (Io): 3A; Reverse Leakage Current (Ir): 500uA@40V
L5 L6 = SMMS0420-150M: 电感值:15uH;精度:±20%;额定电流:1.4A;饱和电流(Isat):1.9A;类型:一体成型电感;; LCSC Part Name: 15uH ±20% 1.9A; Supplier Part: C2894719; Manufacturer: SXN(顺翔诺); Supplier Footprint: SMD,4.6x4.2x2mm; JLCPCB Part Class: 扩展库; Datasheet: https://atta.szlcsc.com/upload/public/pdf/source/20210910/523B6BB0C4A09F37806A127B1ABE761D.pdf; Supplier: LCSC; Tolerance: ±20%; Rated Current: 1.4A; Saturation Current (Isat): 1.9A; DC Resistance (DCR): 320mΩ; Type: 一体成型电感
Q2 = AOD403_C5224305: 类型:1个P沟道;漏源电压(Vdss):30V;连续漏极电流(Id):62A;导通电阻(RDS(on)@Vgs,Id):8mΩ@10V;功率:79W;阈值电压(Vgs(th)@Id):2V@20A;; LCSC Part Name: P沟道,电流:62A,耐压:30V; Supplier Part: C5224305; Manufacturer: ElecSuper(静芯微); Supplier Footprint: TO-252; JLCPCB Part Class: 扩展库; Datasheet: https://atta.szlcsc.com/upload/public/pdf/source/20240905/94D7CD2F64083621076EDE6D140A89A0.pdf; Supplier: LCSC; Type: 1个P沟道; Drain Source Voltage (Vdss): 30V; Continuous Drain Current (Id): 62A; Drain Source On Resistance (RDS(on)@Vgs,Id): 8mΩ@10V; Power Dissipation (Pd): 79W; Gate Threshold Voltage (Vgs(th)@Id): 2V@20A; Total Gate Charge (Qg@Vgs): 61nC; Input Capacitance (Ciss@Vds): 3.5nF@0V; Reverse Transfer Capacitance (Crss@Vds): 660pF@15V; Operating Temperature: -55℃~+150℃
R84 = 0603WAF4701T5E: 电阻类型:厚膜电阻;阻值:4.7kΩ;精度:±1%;功率:100mW;最大工作电压:75V;温度系数:±100ppm/℃;; LCSC Part Name: 4.7kΩ ±1% 100mW 厚膜电阻; Supplier Part: C23162; Manufacturer: UNI-ROYAL(厚声); Supplier Footprint: 0603; JLCPCB Part Class: 基础库; Datasheet: https://atta.szlcsc.com/upload/public/pdf/source/20200306/C422600_1E6D84923E4A46A82E41ADD87F860B5C.pdf; Supplier: LCSC; Type: 厚膜电阻; Tolerance: ±1%; Power(Watts): 100mW; Overload Voltage (Max): 75V; Temperature Coefficient: ±100ppm/℃; Operating Temperature Range: -55℃~+155℃
R85 = 0603WAF1001T5E: 电阻类型:厚膜电阻;阻值:1kΩ;精度:±1%;功率:100mW;最大工作电压:75V;温度系数:±100ppm/℃;; LCSC Part Name: 1kΩ ±1% 100mW 厚膜电阻; Supplier Part: C21190; Manufacturer: UNI-ROYAL(厚声); Supplier Footprint: 0603; JLCPCB Part Class: 基础库; Datasheet: https://atta.szlcsc.com/upload/public/pdf/source/20200306/C422600_1E6D84923E4A46A82E41ADD87F860B5C.pdf; Supplier: LCSC; Type: 厚膜电阻; Tolerance: ±1%; Power(Watts): 100mW; Overload Voltage (Max): 75V; Temperature Coefficient: ±100ppm/℃; Operating Temperature Range: -55℃~+155℃
R89 = FRC0603F1502TS: 电阻类型:厚膜电阻;阻值:15kΩ;精度:±1%;功率:100mW;最大工作电压:75V;温度系数:±100ppm/℃;; LCSC Part Name: 15kΩ ±1% 100mW 厚膜电阻; Supplier Part: C2906995; Manufacturer: FOJAN(富捷); Supplier Footprint: 0603; JLCPCB Part Class: 扩展库; Datasheet: https://atta.szlcsc.com/upload/public/pdf/source/20211221/925EC7D7225764EE0046F22065062C87.pdf; Supplier: LCSC; Type: 厚膜电阻; Tolerance: ±1%; Power(Watts): 100mW; Overload Voltage (Max): 75V; Temperature Coefficient: ±100ppm/℃; Operating Temperature Range: -55℃~+155℃
R99 = 3296W-1-103: 阻值:10kΩ;精度:±10%;; LCSC Part Name: 10kΩ ±10%; Supplier Part: C118954; Manufacturer: BOCHEN(博晨); Supplier Footprint: 插件; JLCPCB Part Class: 扩展库; Datasheet: https://atta.szlcsc.com/upload/public/pdf/source/20171114/C118954_15106326646611117443.pdf; Supplier: LCSC; Tolerance: ±10%
R105 = 0603WAF3301T5E: 电阻类型:厚膜电阻;阻值:3.3kΩ;精度:±1%;功率:100mW;最大工作电压:75V;温度系数:±100ppm/℃;; LCSC Part Name: 3.3kΩ ±1% 100mW 厚膜电阻; Supplier Part: C22978; Manufacturer: UNI-ROYAL(厚声); Supplier Footprint: 0603; JLCPCB Part Class: 基础库; Datasheet: https://atta.szlcsc.com/upload/public/pdf/source/20200306/C422600_1E6D84923E4A46A82E41ADD87F860B5C.pdf; Supplier: LCSC; Type: 厚膜电阻; Tolerance: ±1%; Power(Watts): 100mW; Overload Voltage (Max): 75V; Temperature Coefficient: ±100ppm/℃; Operating Temperature Range: -55℃~+155℃
R106 = 0603WAF1002T5E: 阻值:10kΩ;精度:±1%;功率:100mW;温度系数:±100ppm/℃;电阻类型:厚膜电阻;; LCSC Part Name: 10kΩ ±1% 100mW 厚膜电阻; Supplier Part: C25804; Manufacturer: UNI-ROYAL(厚声); Supplier Footprint: 0603; JLCPCB Part Class: 基础库; Datasheet: https://atta.szlcsc.com/upload/public/pdf/source/20200306/C422600_1E6D84923E4A46A82E41ADD87F860B5C.pdf; Supplier: LCSC; Tolerance: ±1%; Power(Watts): 100mW; Overload Voltage (Max): 75V; Temperature Coefficient: ±100ppm/℃; Type: 厚膜电阻; Operating Temperature Range: -55℃~+155℃
R112 = 0402WGF0000TCE: 电阻类型:厚膜电阻;阻值:0Ω;精度:±1%;功率:62.5mW;最大工作电压:50V;温度系数:±800ppm/℃;; LCSC Part Name: 0Ω ±1% 62.5mW 厚膜电阻; Supplier Part: C17168; Manufacturer: UNI-ROYAL(厚声); Supplier Footprint: 0402; JLCPCB Part Class: 基础库; Datasheet: https://atta.szlcsc.com/upload/public/pdf/source/20200306/C422600_1E6D84923E4A46A82E41ADD87F860B5C.pdf; Supplier: LCSC; Type: 厚膜电阻; Tolerance: ±1%; Power(Watts): 62.5mW; Overload Voltage (Max): 50V; Temperature Coefficient: ±800ppm/℃; Operating Temperature Range: -55℃~+155℃
R113 = FRC0603J472 TS: 电阻类型:厚膜电阻;阻值:4.7kΩ;精度:±5%;功率:100mW;最大工作电压:75V;温度系数:±100ppm/℃;; LCSC Part Name: 4.7kΩ ±5% 100mW 厚膜电阻; Supplier Part: C2907166; Manufacturer: FOJAN(富捷); Supplier Footprint: 0603; Datasheet: https://atta.szlcsc.com/upload/public/pdf/source/20211221/925EC7D7225764EE0046F22065062C87.pdf; Supplier: LCSC; Type: 厚膜电阻; Tolerance: ±5%; Power(Watts): 100mW; Overload Voltage (Max): 75V; Temperature Coefficient: ±100ppm/℃; Operating Temperature Range: -55℃~+155℃
U8 U32 = TPS5430DDA: 功能类型:降压型;输出类型:可调;输入电压:5.5V~36V;输出电压:1.221V~32.04V;输出电流(最大值):3A;; Supplier Part: C502477; Manufacturer: TI(德州仪器); Supplier Footprint: SOP-8-EP; JLCPCB Part Class: 扩展库; Datasheet: https://www.ti.com/cn/lit/gpn/tps5430; Supplier: LCSC; Function: 降压型; Synchronous Rectification: 否; Output Type: 可调; Number of Outputs: 1; Topology: 降压式; Input Voltage: 5.5V~36V; Output Voltage: 1.221V~32.04V; Output Current (Max): 3A; Switching Frequency: 500kHz; Operating Temperature: -40℃~+125℃@(TJ)
U14 = HT7833_C3011187: LCSC Part Name: 500mA 2uA Hight PSRR Voltage Regulator; Supplier Part: C3011187; Manufacturer: TECH PUBLIC(台舟); Supplier Footprint: SOT-23-5; JLCPCB Part Class: 扩展库; Datasheet: https://atta.szlcsc.com/upload/public/pdf/source/20220511/52D8A72EC3CBC44D368221752E30E118.pdf; Supplier: LCSC

## Nets
+3V3: C1.2 C2.2 C3.2 C4.2 C5.2 C57.2 H4.2 H5.2 R96.1 U14.5(OUT)
+5V: C56.2 C79.1 C103.2 C104.2 C105.2 C106.2 C107.2 C108.2 H6.30 H9.9 H10.3 H10.4 L5.2 R104.1 R106.2 SW7.1 U14.1(VIN) U14.3(CE) U20.1(VIO) U20.3(VDD5) U20.9(VBUS)
DGND: C1.1 C5.1 C65.1 C99.1 C100.1 C101.1 C102.1 C103.1 C104.1 C105.1 C108.1 C109.2 H4.1 H5.1 H6.1 H6.19 H6.20 H6.29 H9.6 H10.5 H10.6 LED5.2(-) LED6.2(-) LED7.2(-) LED8.2(-) LED9.2(-) Q1.2(E) R77.2 R78.2 R85.1 R98.2 R112.2 U9.5(GND) U9.16(GND) U9.20(SN) U9.21(SP) U9.25(EP) U20.2(GND) U20.17(EP) U37.5(GND) U37.16(GND) U37.20(SN) U37.21(SP) U37.25(EP) U38.3(GND) U38.8(GND) USB1.1(GND) USB1.12(GND)
PGND: C2.1 C3.1 C4.1 C56.1 C57.1 C70.1 C79.2 C80.1 C81.1 C83.2 C84.1 C91.2 C92.2 C93.2 C94.2 C106.1 C107.1 CN5.1(-) D1.2(A) D3.2(A) H1.3 R105.1 R112.1 R113.1 U8.6(GND) U8.9(EP) U11.1(S) U11.2(S) U11.3(S) U13.1(S) U13.2(S) U13.3(S) U14.2(GND) U32.6(GND) U32.9(EP) U34.1(S) U34.2(S) U34.3(S) U36.1(S) U36.2(S) U36.3(S)
99PI_RXD_0: H6.6 R102.1 U20.4(TXD) U38.5(IO)
99PI_TXD_0: H6.4 R101.1 U20.5(RXD) U38.4(IO)
BUZZER: H6.13 R97.1 R98.1
D+: U20.7(UD+) U38.2(IO) USB1.6(DP1) USB1.8(DP2)
D-: U20.8(UD-) U38.1(IO) USB1.5(DN2) USB1.7(DN1)
ENCODER_DIR_1: H4.4 H6.9
ENCODER_DIR_2: H5.4 H6.7
ENCODER_LSB_1: H4.3 H6.27
ENCODER_LSB_2: H5.3 H6.25
ESC: H6.5 H10.1 H10.2
GPIO_2: H6.11 R103.1
GPIO_4: H6.12 U9.15(PH)
GPIO_5: H6.14 U37.15(PH)
I2C_SCL_0: H6.18 H9.4
I2C_SCL_1: H6.15 H9.10
I2C_SDA_0: H6.16 H9.2
I2C_SDA_1: H6.17 H9.8
LEN: H6.21 U37.14(EN)
LH1: U33.4(G) U37.17(GH1)
LH2: U35.4(G) U37.24(GH2)
LL1: U34.4(G) U37.19(GL1)
LL2: U36.4(G) U37.22(GL2)
LSH1: CN6.2(+) U33.1(S) U33.2(S) U33.3(S) U34.5(D) U37.18(SH1)
LSH2: CN6.1(-) U35.1(S) U35.2(S) U35.3(S) U36.5(D) U37.23(SH2)
NSLEEP: R100.1 SW7.2 U9.13(nSLEEP) U37.13(nSLEEP)
POWER_BAT: CN5.2(+) Q2.3(S) R84.1
POWER_IN: C70.2 C80.2 C81.2 C84.2 D4.2(A) D5.2(A) Q2.2(D) U8.7(VIN) U10.5(D) U12.5(D) U32.7(VIN) U33.5(D) U35.5(D)
PWM_1: H6.23 U9.14(EN)
PWM_4: H1.1 H6.3
RH1: U9.17(GH1) U10.4(G)
RH2: U9.24(GH2) U12.4(G)
RL1: U9.19(GL1) U11.4(G)
RL2: U9.22(GL2) U13.4(G)
RSH1: CN7.2(+) U9.18(SH1) U10.1(S) U10.2(S) U10.3(S) U11.5(D)
RSH2: CN7.1(-) U9.23(SH2) U12.1(S) U12.2(S) U12.3(S) U13.5(D)
SERVO_POWER: C83.1 H1.2 L6.2 R89.2
SPI_CLK_1: H6.22 H9.1
SPI_CS_1: H6.24 H9.3
SPI_MISO_1: H6.26 H9.5
SPI_MOSI_1: H6.28 H9.7
$1N774: C109.1 U20.6(V3)
$1N1611: C65.2 USB1.13(SHELL) USB1.14(SHELL)
$1N1615: R77.1 USB1.4(CC1)
$1N1616: R78.1 USB1.10(CC2)
$1N2181: LED9.1(+) R100.2
$1N2274: LED5.1(+) R101.2
$1N2277: LED6.1(+) R102.2
$1N5007: LED7.1(+) R104.2
$1N5091: LED8.1(+) R103.2
$1N6060: BUZZER2.2(-) Q1.3(C)
$1N6061: BUZZER2.1(+) R96.2
$1N6379: Q1.1(B) R97.2
$2N420: C78.1 D1.1(C) L5.1 U8.8(PH)
$2N423: R105.2 R106.1 U8.4(VSNS)
$2N424: C78.2 U8.1(BOOT)
$2N1388: D6.1(K) R84.2 SW1.1
$2N1393: Q2.1(G) SW1.2
$2N1402: D6.2(A) R85.2 SW1.3
$2N1983: C82.1 D3.1(C) L6.1 U32.8(PH)
$2N1987: C82.2 U32.1(BOOT)
$2N2225: R89.1 R99.2
$3N995: C100.2 U9.8(DVDD)
$3N996: C99.2 U9.6(VREF) U9.7(AVDD) U9.12(IDRIVE)
$3N998: C98.2 U9.3(CPH)
$3N1000: C93.1 C94.1 C95.1 D4.1(K) U9.1(VM)
$3N1001: C95.2 U9.2(VCP)
$3N1943: C101.2 U37.8(DVDD)
$3N1944: C102.2 U37.6(VREF) U37.7(AVDD) U37.12(IDRIVE)
$3N1946: C97.2 U37.3(CPH)
$3N1948: C91.1 C92.1 C96.1 D5.1(K) U37.1(VM)
$3N1949: C96.2 U37.2(VCP)
$3N2353: C97.1 U37.4(CPL)
$3N2389: C98.1 U9.4(CPL)
Net-(R99-3): R99.3 R113.2 U32.4(VSNS)

Not connected (* = marked no-connect by the designer): BUZZER2 3(NC)*; H4 5* 6*; H5 5* 6*; H6 2* 8* 10*; R99 1*; SW1 0*; SW7 0* 3*; U8 2(NC)* 3(NC)* 5(ENA)*; U9 9(nFAULT)* 10(SNSOUT)* 11(SO)*; U14 4(NC)*; U20 10(ACT#)* 11(DCD)* 12(DTRTNOW)* 13(RTS)* 14(DSR)* 15(CTS)* 16(RI)*; U32 2(NC)* 3(NC)* 5(ENA)*; U37 9(nFAULT)* 10(SNSOUT)* 11(SO)*; U38 6(NC)* 7(NC)* 9(NC)* 10(NC)*; USB1 2(VBUS)* 3(SBU2)* 9(SBU1)* 11(VBUS)*

## Notes on the sheets
sheet 1
- 99PI
- USB-TTL
- ENCODER
- CH34X
- ESC
- USB
- LED
- DOCKER
- TVS
- SERVO
- BUZZER
sheet 2
- BAT-5V
- SERVO_POWER
- 5V-3V3
- FILTER
- POWER_IN
- INTERFACE
- SWITCH
sheet 3
- H_BRIDGE
- R_BRIDGE_MOS_DRIVER
- L_BRIDGE_MOS_DRIVER
- DRIVER_EN
